# EAGLE design relais-with-led-indicator (EAGLE 7.2.0)
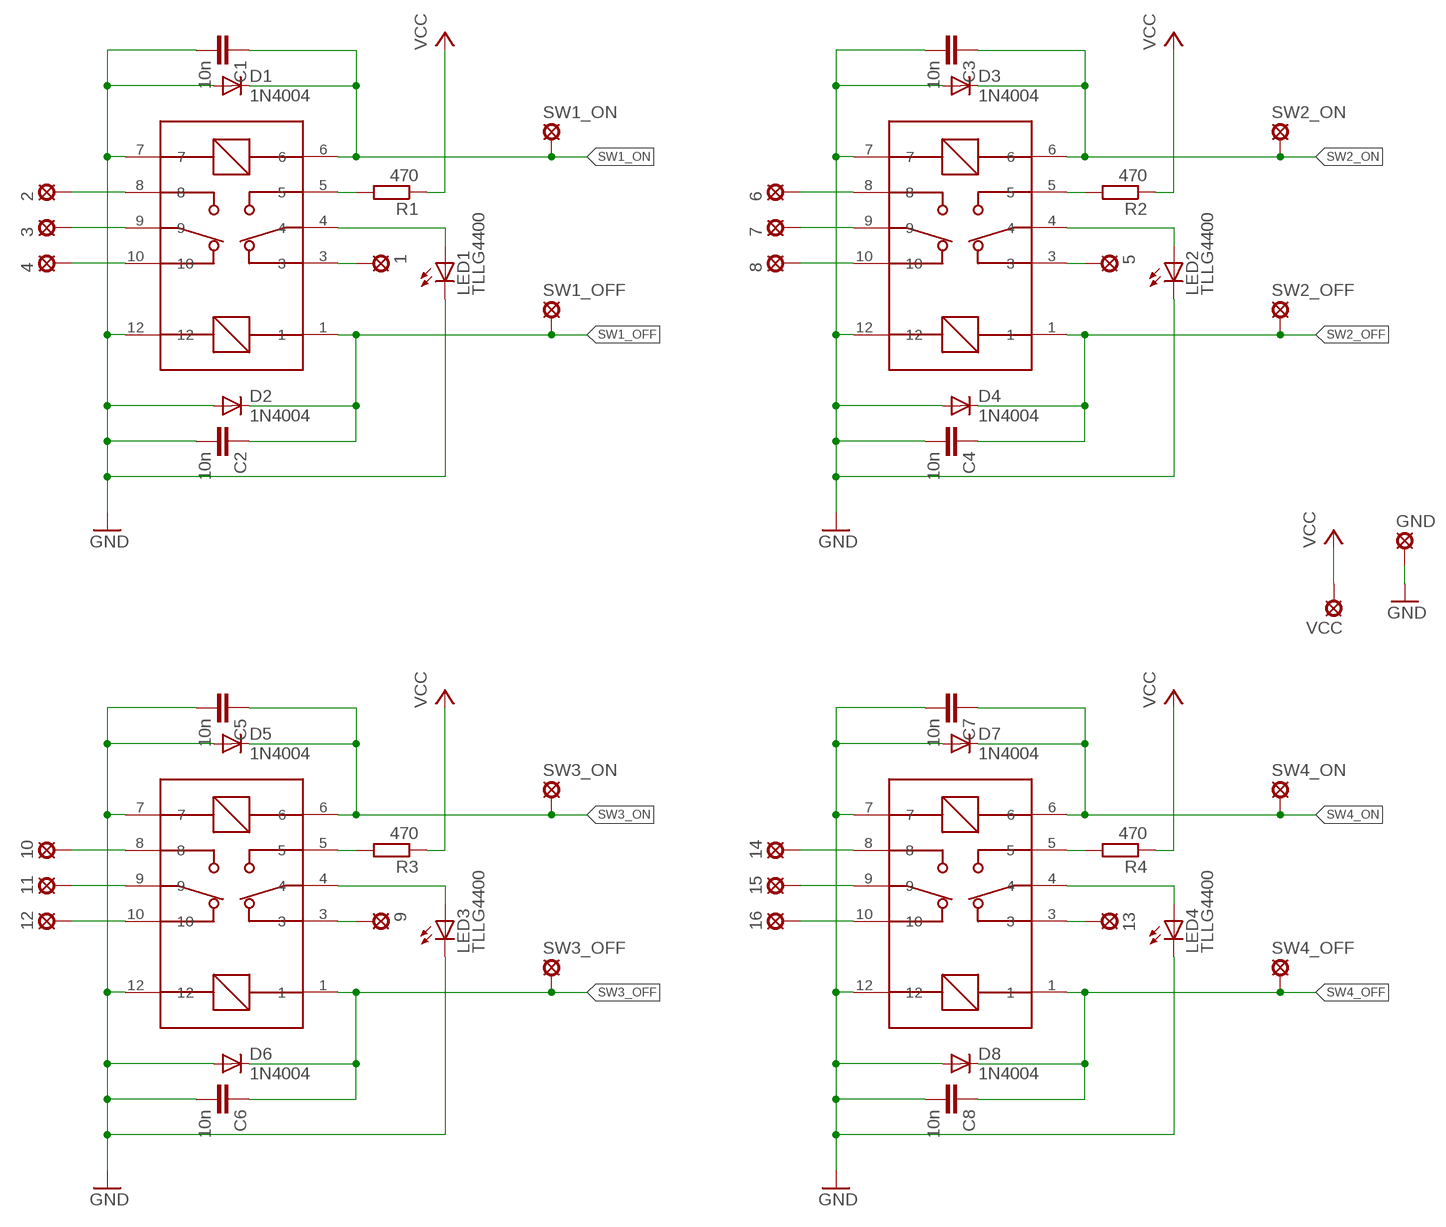
[diagram p0: schematic, sheet 1]

## Parts
1  LSP10  [LSP10]
2  LSP10  [LSP10]
3  LSP10  [LSP10]
4  LSP10  [LSP10]
5  LSP10  [LSP10]
6  LSP10  [LSP10]
7  LSP10  [LSP10]
8  LSP10  [LSP10]
9  LSP10  [LSP10]
10  LSP10  [LSP10]
11  LSP10  [LSP10]
12  LSP10  [LSP10]
13  LSP10  [LSP10]
14  LSP10  [LSP10]
15  LSP10  [LSP10]
16  LSP10  [LSP10]
C1  10n  C-EU050-024X044  [C050-024X044]
C2  10n  C-EU050-024X044  [C050-024X044]
C3  10n  C-EU050-024X044  [C050-024X044]
C4  10n  C-EU050-024X044  [C050-024X044]
C5  10n  C-EU050-024X044  [C050-024X044]
C6  10n  C-EU050-024X044  [C050-024X044]
C7  10n  C-EU050-024X044  [C050-024X044]
C8  10n  C-EU050-024X044  [C050-024X044]
D1  1N4004  [DO41-10]
D2  1N4004  [DO41-10]
D3  1N4004  [DO41-10]
D4  1N4004  [DO41-10]
D5  1N4004  [DO41-10]
D6  1N4004  [DO41-10]
D7  1N4004  [DO41-10]
D8  1N4004  [DO41-10]
GND  LSP10  [LSP10]
LED1  TLLG4400  [LED3MM]
LED2  TLLG4400  [LED3MM]
LED3  TLLG4400  [LED3MM]
LED4  TLLG4400  [LED3MM]
R1  470  R0204/7  [0204/7]
R2  470  R0204/7  [0204/7]
R3  470  R0204/7  [0204/7]
R4  470  R0204/7  [0204/7]
RL1  BISTABIL-2-COILS  [BISTABILE-2-COILS]
RL2  BISTABIL-2-COILS  [BISTABILE-2-COILS]
RL3  BISTABIL-2-COILS  [BISTABILE-2-COILS]
RL4  BISTABIL-2-COILS  [BISTABILE-2-COILS]
SW1_OFF  LSP10  [LSP10]
SW1_ON  LSP10  [LSP10]
SW2_OFF  LSP10  [LSP10]
SW2_ON  LSP10  [LSP10]
SW3_OFF  LSP10  [LSP10]
SW3_ON  LSP10  [LSP10]
SW4_OFF  LSP10  [LSP10]
SW4_ON  LSP10  [LSP10]
VCC  LSP10  [LSP10]

## Nets
GND: C1.2 C2.2 C3.2 C4.2 C5.2 C6.2 C7.2 C8.2 D1.A D2.A D3.A D4.A D5.A D6.A D7.A D8.A GND.MP LED1.K(C) LED2.K(C) LED3.K(C) LED4.K(C) RL1.7 RL1.12 RL2.7 RL2.12 RL3.7 RL3.12 RL4.7 RL4.12
N$1: LED1.A RL1.4
N$2: LED2.A RL2.4
N$3: 4.MP RL1.10
N$4: R2.2 RL2.5
N$5: R1.2 RL1.5
N$6: 8.MP RL2.10
N$7: 7.MP RL2.9
N$8: 6.MP RL2.8
N$9: 5.MP RL2.3
N$10: LED3.A RL3.4
N$11: 3.MP RL1.9
N$12: 2.MP RL1.8
N$13: 1.MP RL1.3
N$14: R3.2 RL3.5
N$15: 12.MP RL3.10
N$16: 11.MP RL3.9
N$17: 10.MP RL3.8
N$18: 9.MP RL3.3
N$19: LED4.A RL4.4
N$20: R4.2 RL4.5
N$21: 16.MP RL4.10
N$22: 15.MP RL4.9
N$23: 14.MP RL4.8
N$24: 13.MP RL4.3
SW1_OFF: C2.1 D2.C RL1.1 SW1_OFF.MP
SW1_ON: C1.1 D1.C RL1.6 SW1_ON.MP
SW2_OFF: C4.1 D4.C RL2.1 SW2_OFF.MP
SW2_ON: C3.1 D3.C RL2.6 SW2_ON.MP
SW3_OFF: C6.1 D6.C RL3.1 SW3_OFF.MP
SW3_ON: C5.1 D5.C RL3.6 SW3_ON.MP
SW4_OFF: C8.1 D8.C RL4.1 SW4_OFF.MP
SW4_ON: C7.1 D7.C RL4.6 SW4_ON.MP
VCC: R1.1 R2.1 R3.1 R4.1 VCC.MP

## Library data of the parts
1-16 GND SW1_OFF SW1_ON SW2_OFF SW2_ON SW3_OFF SW3_ON SW4_OFF SW4_ON VCC = solpad:LSP10: SOLDER PAD drill 1.0 mm, distributor Buerklin, 12H555
C1-C8 = rcl:C-EU: CAPACITOR, European symbol
D1-D8 = diode:1N4004: DIODE general purpose rectifier, 1 A
LED1-LED4 = led:TLLG4400: Low Current (2mA) LED 3 mm Tinted Diffused Package color GREEN Source: Data sheet <http://www.farnell.com/datasheets/391098.pdf>; MF: VISHAY SEMICONDUCTOR; OC_FARNELL: 1612435
R1-R4 = eagle-ltspice:R: RESISTOR, European symbol; SPICEMODEL: NONE; SPICEPREFIX: R
RL1-RL4 = farnell-coax-bistabil:BISTABIL-2-COILS

## Board
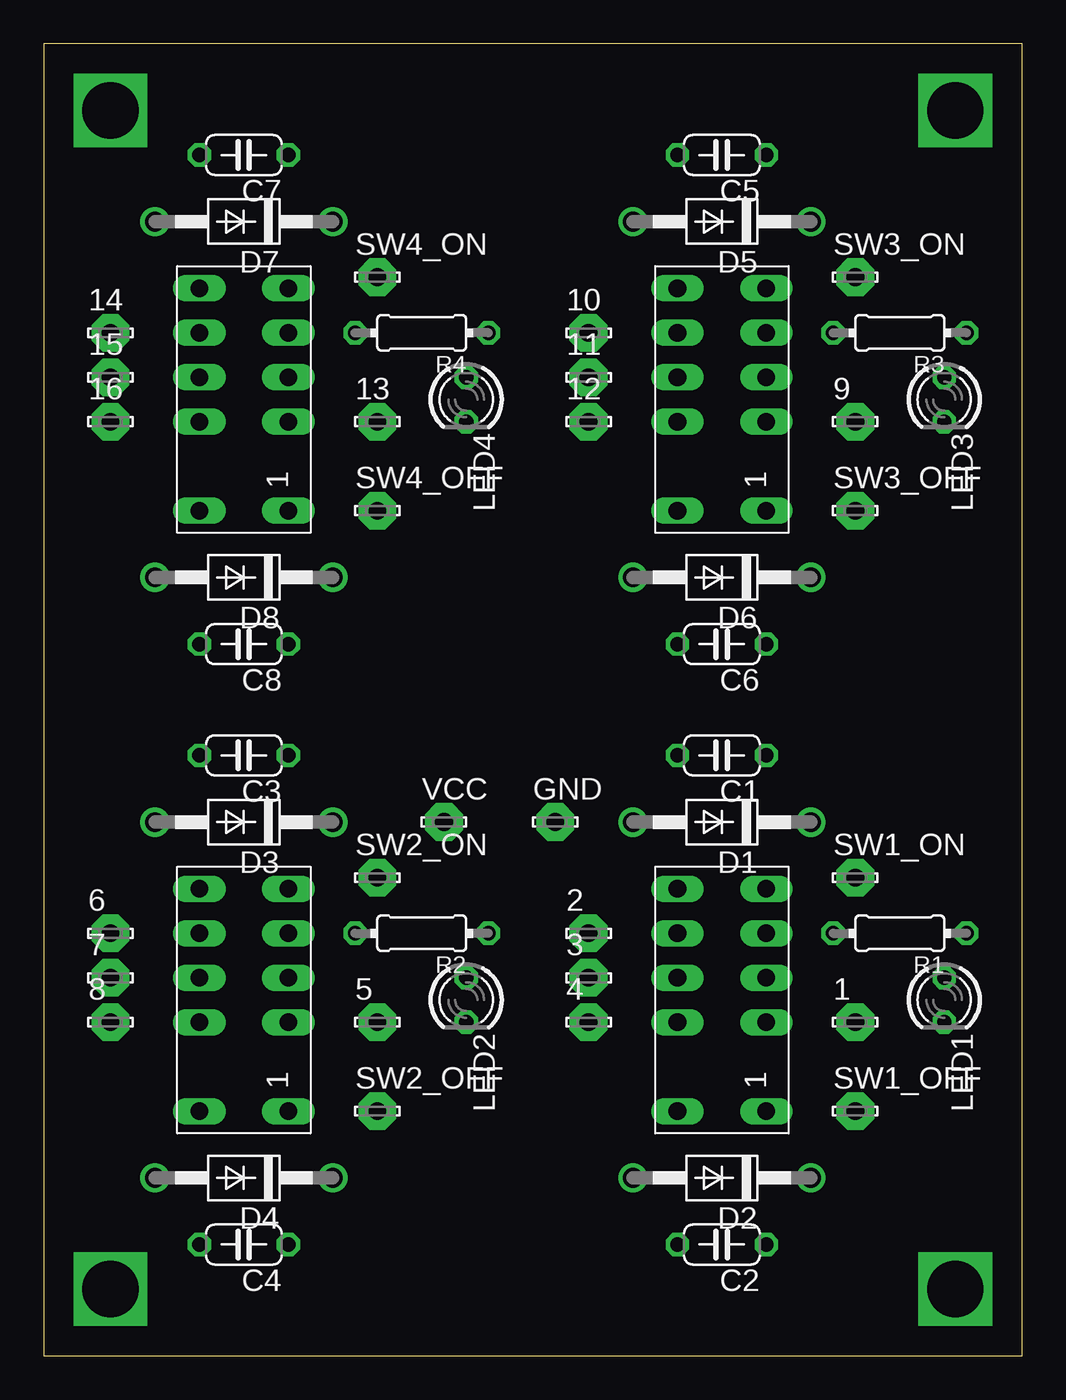
[diagram p1: board, top side]
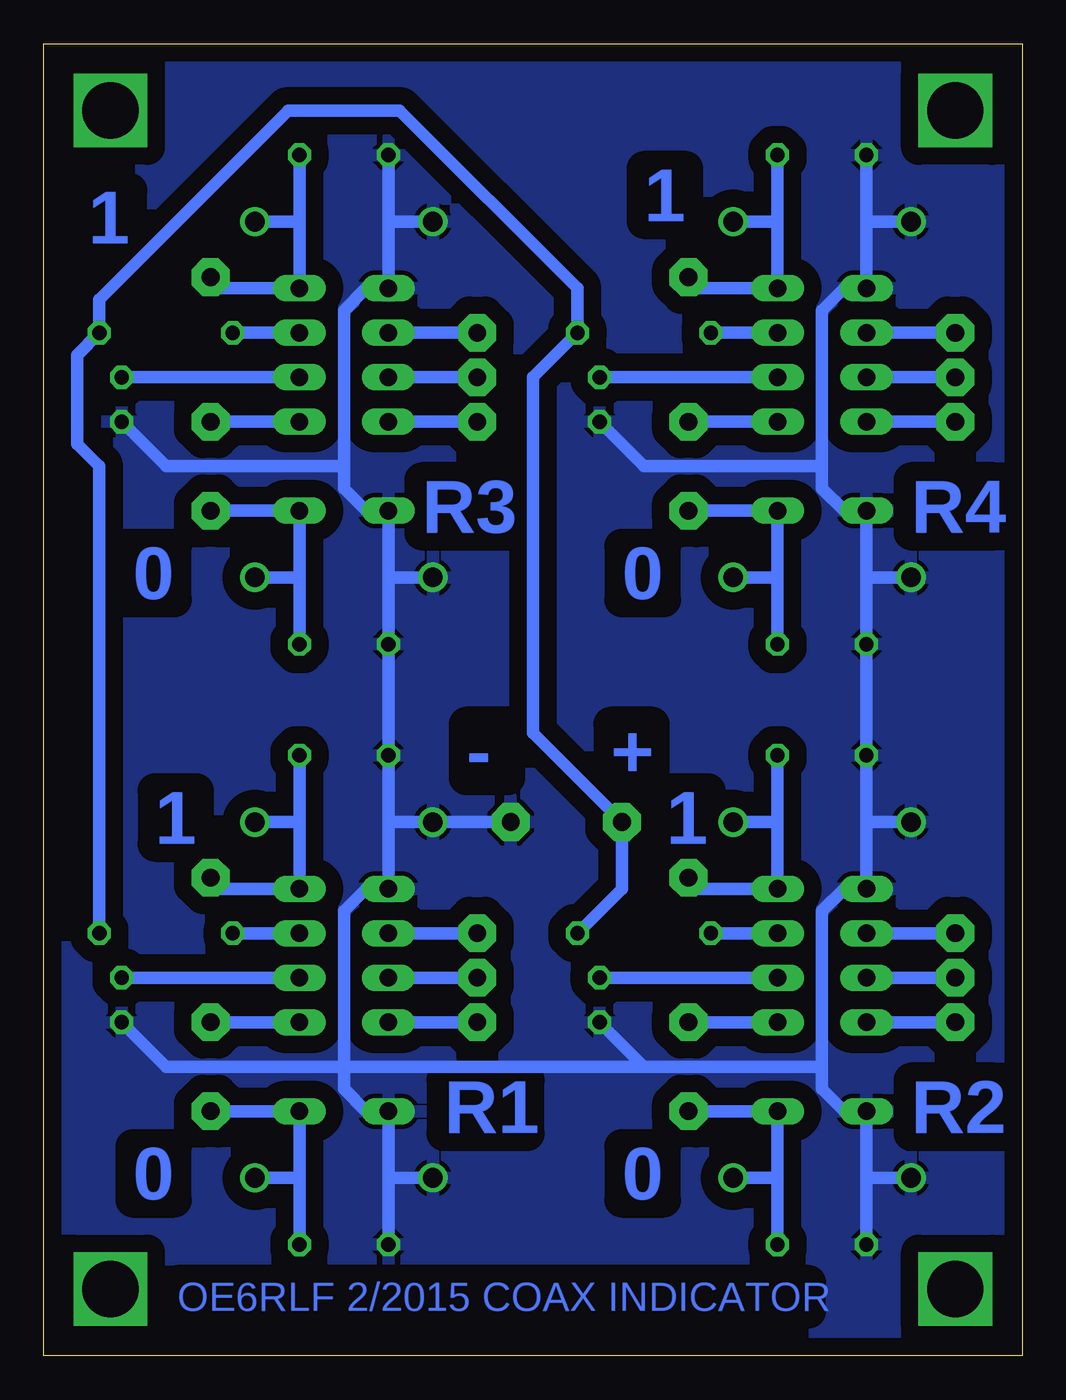
[diagram p2: board, bottom side, seen from below]

Size 55.88 x 74.93 mm. Coordinates in mm from the lower left corner, seen from the top.
Outline: 0,0 55.88,0 55.88,74.93 0,74.92 0,0
Copper layers (1*16): Top 0.035mm / dielectric 1.5mm / Bottom 0.035mm
Design rules "default *": minimum track width 10mil, minimum drill 24mil, track to track 14mil, track to pad 14mil, pad to pad 14mil, via to via 14mil, smd to smd 14mil, copper to edge 40mil, drill to drill 8mil, minimum pad ring 10mil, minimum via ring 8mil, stop-mask expansion 4mil, vias tented up to drill 0mil, thermal gap 10mil

### Footprints (pad centres in the part's own frame; a part is rotated, then mirrored left to right if it is on the bottom)
LSP10 = drill 1.016 pad 2.159 octagon: MP 0,0
C050-024X044 = drill 0.813 octagon: 1 -2.54,0; 2 2.54,0
DO41-10 = drill 1.118: A 5.08,0; C -5.08,0
LED3MM = drill 0.813 octagon: A -1.27,0; K 1.27,0
0204/7 = drill 0.813 octagon: 1 -3.81,0; 2 3.81,0
BISTABILE-2-COILS = drill 1 long: 1 -7.62,-2.54; 3 -2.54,-2.54; 4 0,-2.54; 5 2.54,-2.54; 6 5.08,-2.54; 7 5.08,2.54; 8 2.54,2.54; 9 0,2.54; 10 -2.54,2.54; 12 -7.62,2.54

### Placement (x,y rotation side)
1  46.35,19.05 0 top
2  31.11,24.13 0 top
3  31.11,21.59 0 top
4  31.11,19.05 0 top
5  19.05,19.05 0 top
6  3.81,24.13 0 top
7  3.81,21.59 0 top
8  3.81,19.05 0 top
9  46.35,53.34 0 top
10  31.11,58.42 0 top
11  31.11,55.88 0 top
12  31.11,53.34 0 top
13  19.05,53.34 0 top
14  3.81,58.42 0 top
15  3.81,55.88 0 top
16  3.81,53.34 0 top
C1  38.73,34.29 180 top
C2  38.73,6.35 180 top
C3  11.43,34.29 180 top
C4  11.43,6.35 180 top
C5  38.73,68.58 180 top
C6  38.73,40.64 180 top
C7  11.43,68.58 180 top
C8  11.43,40.64 180 top
D1  38.73,30.48 180 top
D2  38.73,10.16 180 top
D3  11.43,30.48 180 top
D4  11.43,10.16 180 top
D5  38.73,64.77 180 top
D6  38.73,44.45 180 top
D7  11.43,64.77 180 top
D8  11.43,44.45 180 top
GND  29.21,30.48 0 top
LED1  51.44,20.32 270 top
LED2  24.13,20.32 270 top
LED3  51.44,54.61 270 top
LED4  24.13,54.61 270 top
R1  48.9,24.13 180 top
R2  21.59,24.13 180 top
R3  48.9,58.42 180 top
R4  21.59,58.42 180 top
RL1  38.73,21.59 90 top
RL2  11.43,21.59 90 top
RL3  38.73,55.88 90 top
RL4  11.43,55.88 90 top
SW1_OFF  46.35,13.97 0 top
SW1_ON  46.35,27.3 0 top
SW2_OFF  19.05,13.97 0 top
SW2_ON  19.05,27.3 0 top
SW3_OFF  46.35,48.26 0 top
SW3_ON  46.35,61.59 0 top
SW4_OFF  19.05,48.26 0 top
SW4_ON  19.05,61.59 0 top
VCC  22.86,30.48 0 top

### Tracks (layer width: path | path; a pad name or v marks a point on that pad's centre or on a via)
GND
  Bottom 0.7: 38.73,16.51 38.73,25.4 37.47,26.67 RL1.7 36.2,30.48 | 38.73,16.51 38.73,15.24 37.47,13.97 RL1.12 36.2,10.16 | C2.2 36.2,10.16 | 38.73,16.51 48.9,16.51 LED1.K | 36.2,30.48 C1.2 C6.2 36.2,44.45 | 34.29,10.16 D2.A 36.2,10.16 | 11.43,16.51 11.43,25.4 10.16,26.67 RL2.7 8.89,30.48 | 11.43,16.51 11.43,15.24 10.16,13.97 RL2.12 8.89,10.16 | 8.89,10.16 C4.2 | D4.A 8.89,10.16 | 8.89,30.48 C3.2 C8.2 8.89,44.45 | D3.A 8.89,30.48 | LED2.K 21.59,16.51 | 21.59,16.51 11.43,16.51 | 36.2,44.45 RL3.12 37.47,48.26 38.73,49.53 38.73,50.8 | D6.A 36.2,44.45 | 38.73,50.8 38.73,59.69 37.47,60.96 RL3.7 36.2,64.77 | LED3.K 48.9,50.8 38.73,50.8 | C5.2 36.2,64.77 | D5.A 36.2,64.77 | 11.43,50.8 11.43,59.69 10.16,60.96 RL4.7 8.89,64.77 | 11.43,50.8 11.43,49.53 10.16,48.26 RL4.12 8.89,44.45 | C7.2 8.89,64.77 | D7.A 8.89,64.77 | D8.A 8.89,44.45 | LED4.K 21.59,50.8 11.43,50.8 | 21.59,16.51 38.73,16.51 | GND.MP D1.A 36.2,30.48
  pour Bottom (isolate 1): -2.54,76.2 58.42,76.2 58.42,-1.27 -2.54,-1.27
N$1
  Bottom 0.7: RL1.4 LED1.A
N$2
  Bottom 0.7: RL2.4 LED2.A
N$3
  Bottom 0.7: 4.MP RL1.10
N$4
  Bottom 0.7: R2.2 RL2.5
N$5
  Bottom 0.7: RL1.5 R1.2
N$6
  Bottom 0.7: 8.MP RL2.10
N$7
  Bottom 0.7: 7.MP RL2.9
N$8
  Bottom 0.7: 6.MP RL2.8
N$9
  Bottom 0.7: RL2.3 5.MP
N$10
  Bottom 0.7: RL3.4 LED3.A
N$11
  Bottom 0.7: 3.MP RL1.9
N$12
  Bottom 0.7: 2.MP RL1.8
N$13
  Bottom 0.7: RL1.3 1.MP
N$14
  Bottom 0.7: RL3.5 R3.2
N$15
  Bottom 0.7: 12.MP RL3.10
N$16
  Bottom 0.7: 11.MP RL3.9
N$17
  Bottom 0.7: 10.MP RL3.8
N$18
  Bottom 0.7: RL3.3 9.MP
N$19
  Bottom 0.7: RL4.4 LED4.A
N$20
  Bottom 0.7: RL4.5 R4.2
N$21
  Bottom 0.7: RL4.10 16.MP
N$22
  Bottom 0.7: RL4.9 15.MP
N$23
  Bottom 0.7: RL4.8 14.MP
N$24
  Bottom 0.7: RL4.3 13.MP
N$25  (via drill 3.2)
  other vias: 3.81,71.12
N$26  (via drill 3.2)
  other vias: 52.07,71.12
N$27  (via drill 3.2)
  other vias: 3.81,3.81
N$28  (via drill 3.2)
  other vias: 52.07,3.81
SW1_OFF
  Bottom 0.7: SW1_OFF.MP RL1.1 41.27,10.16 | C2.1 41.27,10.16 | D2.C 41.27,10.16
SW1_ON
  Bottom 0.7: 41.27,30.48 RL1.6 45.72,26.67 SW1_ON.MP | 41.27,30.48 C1.1 | 43.18,30.48 D1.C 41.27,30.48
SW2_OFF
  Bottom 0.7: 13.97,10.16 RL2.1 SW2_OFF.MP | 13.97,10.16 C4.1 | D4.C 13.97,10.16
SW2_ON
  Bottom 0.7: C3.1 13.97,30.48 | 13.97,30.48 RL2.6 18.41,26.67 SW2_ON.MP | D3.C 13.97,30.48
SW3_OFF
  Bottom 0.7: 41.27,44.45 RL3.1 SW3_OFF.MP | 41.27,44.45 C6.1 | D6.C 41.27,44.45
SW3_ON
  Bottom 0.7: SW3_ON.MP 45.72,60.96 RL3.6 41.27,64.77 | C5.1 41.27,64.77 | D5.C 41.27,64.77
SW4_OFF
  Bottom 0.7: 13.97,44.45 RL4.1 SW4_OFF.MP | 13.97,44.45 C8.1 | D8.C 13.97,44.45
SW4_ON
  Bottom 0.7: SW4_ON.MP 18.41,60.96 RL4.6 13.97,64.77 | 13.97,64.77 C7.1 | D7.C 13.97,64.77
VCC
  Bottom 0.7: R2.1 22.86,26.67 VCC.MP 27.94,35.56 27.94,55.88 R4.1 25.4,60.96 35.56,71.12 41.91,71.12 52.7,60.33 R3.1 53.98,57.15 53.98,52.07 52.7,50.8 R1.1

### Text on the board
Bottom: 1 | 1 | R4 | R3 | 0 | 0 | + | - | 1 | 1 | R2 | R1 | 0 | 0 | OE6RLF 2/2015 COAX INDICATOR